# Altium schematic sheet Even.SchDoc
size A
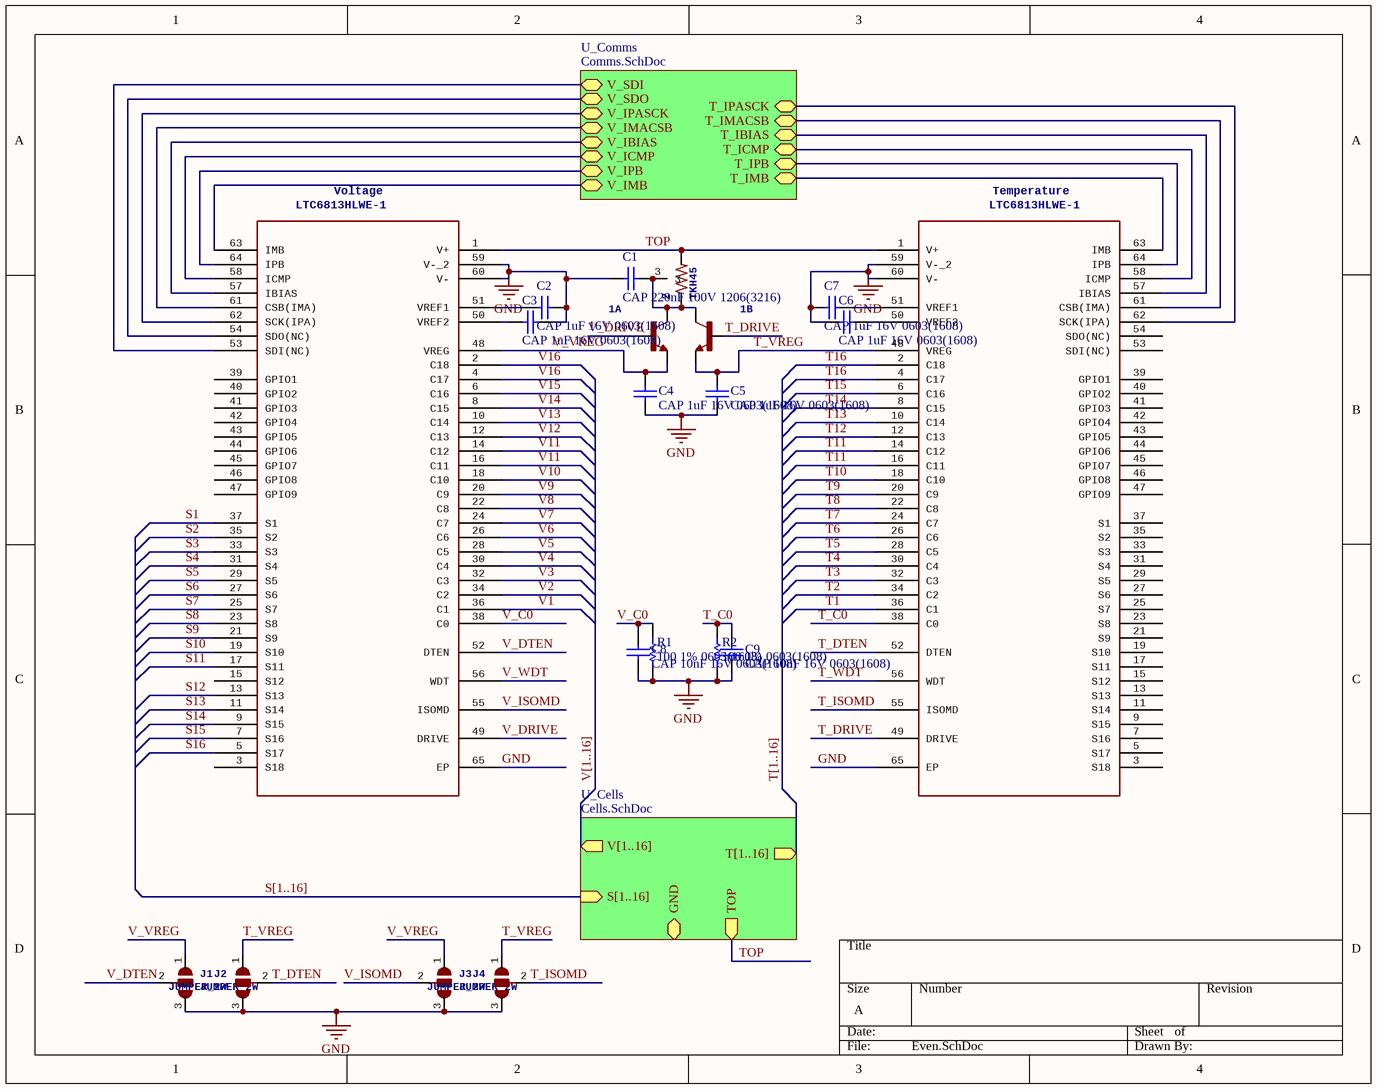
[diagram p0: Even.SchDoc]

## Parts
1  PHPT610030NK  [LFPAK56D]  (value not drawn)  (parts A,B of 2)
2  TKH45  [TO252-TKH-45]
C1  CAP 220nF 100V 1206(3216)  [CAPC1206(3216)190_L]
C2  CAP 1uF 16V 0603(1608)  [CAPC0603(1608)100_N]
C3  CAP 1uF 16V 0603(1608)  [CAPC0603(1608)100_N]
C4  CAP 1uF 16V 0603(1608)  [CAPC0603(1608)100_N]
C5  CAP 1uF 16V 0603(1608)  [CAPC0603(1608)100_N]
C6  CAP 1uF 16V 0603(1608)  [CAPC0603(1608)100_N]
C7  CAP 1uF 16V 0603(1608)  [CAPC0603(1608)100_N]
C8  CAP 10nF 16V 0603(1608)  [CAPC0603(1608)100_L]
C9  CAP 10nF 16V 0603(1608)  [CAPC0603(1608)100_L]
J1  JUMPER_2W  [SJ_2]
J2  JUMPER_2W  [SJ_2]
J3  JUMPER_2W  [SJ_2]
J4  JUMPER_2W  [SJ_2]
R1  100 1% 0603(1608)  [RESC0603(1608)_L]
R2  100 1% 0603(1608)  [RESC0603(1608)_L]
Temperature  LTC6813HLWE-1  [LQFP64_LWE_A]
Voltage  LTC6813HLWE-1  [LQFP64_LWE_A]

## Sub-sheets
U_Cells = Cells.SchDoc: GND (bidir), S[1..16] (in), T[1..16] (out), TOP (out), V[1..16] (out)
U_Comms = Comms.SchDoc: V_SDI (bidir), V_SDO (bidir), V_IMACSB (bidir), V_IPASCK (bidir), V_IPB (bidir), V_IMB (bidir), V_ICMP (bidir), V_IBIAS (bidir), T_IMACSB (bidir), T_IPASCK (bidir), T_IPB (bidir), T_IMB (bidir), T_IBIAS (bidir), T_ICMP (bidir)

## Nets
GND: C1.1 C2.2 C3.2 C4.1 C5.1 C6.1 C7.1 C8.2 C9.1 J1.3 J2.3 J3.3 J4.3 R1.1 R2.2 Temperature.59(V-_2) Temperature.60(V-) Temperature.65(EP) Voltage.59(V-_2) Voltage.60(V-) Voltage.65(EP)
S1: Voltage.37(S1)
S2: Voltage.35(S2)
S3: Voltage.33(S3)
S4: Voltage.31(S4)
S5: Voltage.29(S5)
S6: Voltage.27(S6)
S7: Voltage.25(S7)
S8: Voltage.23(S8)
S9: Voltage.21(S9)
S10: Voltage.19(S10)
S11: Voltage.17(S11)
S12: Voltage.13(S13)
S13: Voltage.11(S14)
S14: Voltage.9(S15)
S15: Voltage.7(S16)
S16: Voltage.5(S17)
T1: Temperature.36(C1)
T2: Temperature.34(C2)
T3: Temperature.32(C3)
T4: Temperature.30(C4)
T5: Temperature.28(C5)
T6: Temperature.26(C6)
T7: Temperature.24(C7)
T8: Temperature.22(C8)
T9: Temperature.20(C9)
T10: Temperature.18(C10)
T11: Temperature.14(C12) Temperature.16(C11)
T12: Temperature.12(C13)
T13: Temperature.10(C14)
T14: Temperature.8(C15)
T15: Temperature.6(C16)
T16: Temperature.2(C18) Temperature.4(C17)
T_C0: C9.2 R2.1 Temperature.38(C0)
T_DRIVE: 1.B2(B) Temperature.49(DRIVE)
T_DTEN: J2.2 Temperature.52(DTEN)
T_ISOMD: J4.2 Temperature.55(ISOMD)
T_VREG: 1.E2(E) C5.2 J2.1 J4.1 Temperature.48(VREG)
T_WDT: Temperature.56(WDT)
TOP: 2.2 Temperature.1(V+) Voltage.1(V+) ; sheet U_Cells/TOP
V1: Voltage.36(C1)
V2: Voltage.34(C2)
V3: Voltage.32(C3)
V4: Voltage.30(C4)
V5: Voltage.28(C5)
V6: Voltage.26(C6)
V7: Voltage.24(C7)
V8: Voltage.22(C8)
V9: Voltage.20(C9)
V10: Voltage.18(C10)
V11: Voltage.14(C12) Voltage.16(C11)
V12: Voltage.12(C13)
V13: Voltage.10(C14)
V14: Voltage.8(C15)
V15: Voltage.6(C16)
V16: Voltage.2(C18) Voltage.4(C17)
V_C0: C8.1 R1.2 Voltage.38(C0)
V_DRIVE: 1.B1(B) Voltage.49(DRIVE)
V_DTEN: J1.2 Voltage.52(DTEN)
V_ISOMD: J3.2 Voltage.55(ISOMD)
V_VREG: 1.E1(E) C4.2 J1.1 J3.1 Voltage.48(VREG)
V_WDT: Voltage.56(WDT)
Net1_C1: 1.C1(C) 1.C2(C) 2.1 2.3 C1.2
NetC2_1: C2.1 Voltage.51(VREF1)
NetC3_1: C3.1 Voltage.50(VREF2)
NetC6_2: C6.2 Temperature.50(VREF2)
NetC7_2: C7.2 Temperature.51(VREF1)
NetTemperature_57: Temperature.57(IBIAS) ; sheet U_Comms/T_IBIAS
NetTemperature_58: Temperature.58(ICMP) ; sheet U_Comms/T_ICMP
NetTemperature_61: Temperature.61(CSB(IMA)) ; sheet U_Comms/T_IMACSB
NetTemperature_62: Temperature.62(SCK(IPA)) ; sheet U_Comms/T_IPASCK
NetTemperature_63: Temperature.63(IMB) ; sheet U_Comms/T_IMB
NetTemperature_64: Temperature.64(IPB) ; sheet U_Comms/T_IPB
NetVoltage_53: Voltage.53(SDI(NC)) ; sheet U_Comms/V_SDI
NetVoltage_54: Voltage.54(SDO(NC)) ; sheet U_Comms/V_SDO
NetVoltage_57: Voltage.57(IBIAS) ; sheet U_Comms/V_IBIAS
NetVoltage_58: Voltage.58(ICMP) ; sheet U_Comms/V_ICMP
NetVoltage_61: Voltage.61(CSB(IMA)) ; sheet U_Comms/V_IMACSB
NetVoltage_62: Voltage.62(SCK(IPA)) ; sheet U_Comms/V_IPASCK
NetVoltage_63: Voltage.63(IMB) ; sheet U_Comms/V_IMB
NetVoltage_64: Voltage.64(IPB) ; sheet U_Comms/V_IPB

Not connected (* = marked no-connect by the designer): Temperature 3(S18) 5(S17) 7(S16) 9(S15) 11(S14) 13(S13) 15(S12) 17(S11) 19(S10) 21(S9) 23(S8) 25(S7) 27(S6) 29(S5) 31(S4) 33(S3) 35(S2) 37(S1) 39(GPIO1) 40(GPIO2) 41(GPIO3) 42(GPIO4) 43(GPIO5) 44(GPIO6) 45(GPIO7) 46(GPIO8) 47(GPIO9) 53(SDI(NC)) 54(SDO(NC)); Voltage 3(S18) 15(S12) 39(GPIO1) 40(GPIO2) 41(GPIO3) 42(GPIO4) 43(GPIO5) 44(GPIO6) 45(GPIO7) 46(GPIO8) 47(GPIO9)

## Buses and harness runs
bus S[1..16] = sheet U_Cells/S[1..16]
bus T[1..16] = sheet U_Cells/T[1..16]
bus V[1..16] = sheet U_Cells/V[1..16]

## Library data of the parts
1 = PHPT610030NK: GateName_1: G$1; SymbolName_1: NPN; GateName_2: G$2; SymbolName_2: NPN; LibraryName: IFE_Transistors; DeviceSetName: PHPT610030NK; Package: LFPAK56D
2 = TKH45: GateName_1: G$1; SymbolName_1: R-US; LibraryName: IFE_Resistors; DeviceSetName: TKH45; Package: TO252-TKH-45
C1 = CMP-1037-04407-1: CAP 220nF 100V ±10% 1206 (3216 Metric) Thickness 1.9mm SMD; Tolerance: Â±10%; Case-EIA: 1206; Case-Metric: 3216; Technology: SMT; Max Thickness: 1.9 mm; Rated Voltage: 100 V; Value: 220nF
C2-C7 = CMP-1035-02736-1: CAP 1uF 16V ±5% 0603 (1608 Metric) Thickness 1mm SMD; Case-Metric: 1608; Case-EIA: 0603; Tolerance: Â±5%; Technology: SMT; Max Thickness: 1 mm; Rated Voltage: 16 V; Value: 1uF
C8 C9 = CMP-1035-02309-1: CAP 10nF 16V ±1% 0603 (1608 Metric) Thickness 1mm SMD; Case-Metric: 1608; Tolerance: Â±1%; Case-EIA: 0603; Rated Voltage: 16 V; Technology: SMT; Max Thickness: 1 mm; Value: 10nF
J1-J4 = JUMPER_2W: GateName_1: G$1; SymbolName_1: SJ_2; LibraryName: IFE_Jumpers; DeviceSetName: JUMPER_2W; Package: SJ_2
R1 R2 = CMP-1012-00222-1: 2R94 0.1W 1% 0603 (1608 Metric)  SMD; Case-Metric: 1608; Case-EIA: 0603; Value: 2.94 Ohm; Power: 0.1 W; Technology: SMT; Tolerance: 1 %
Temperature Voltage = LTC6813HLWE-1: GateName_1: A; SymbolName_1: LTC6813XLWE-1; LibraryName: LTC6813_Official; DeviceSetName: LTC6813HLWE-1; Package: LQFP64_LWE_A